# EAGLE design smart_watch_shield (EAGLE 9.4.2)
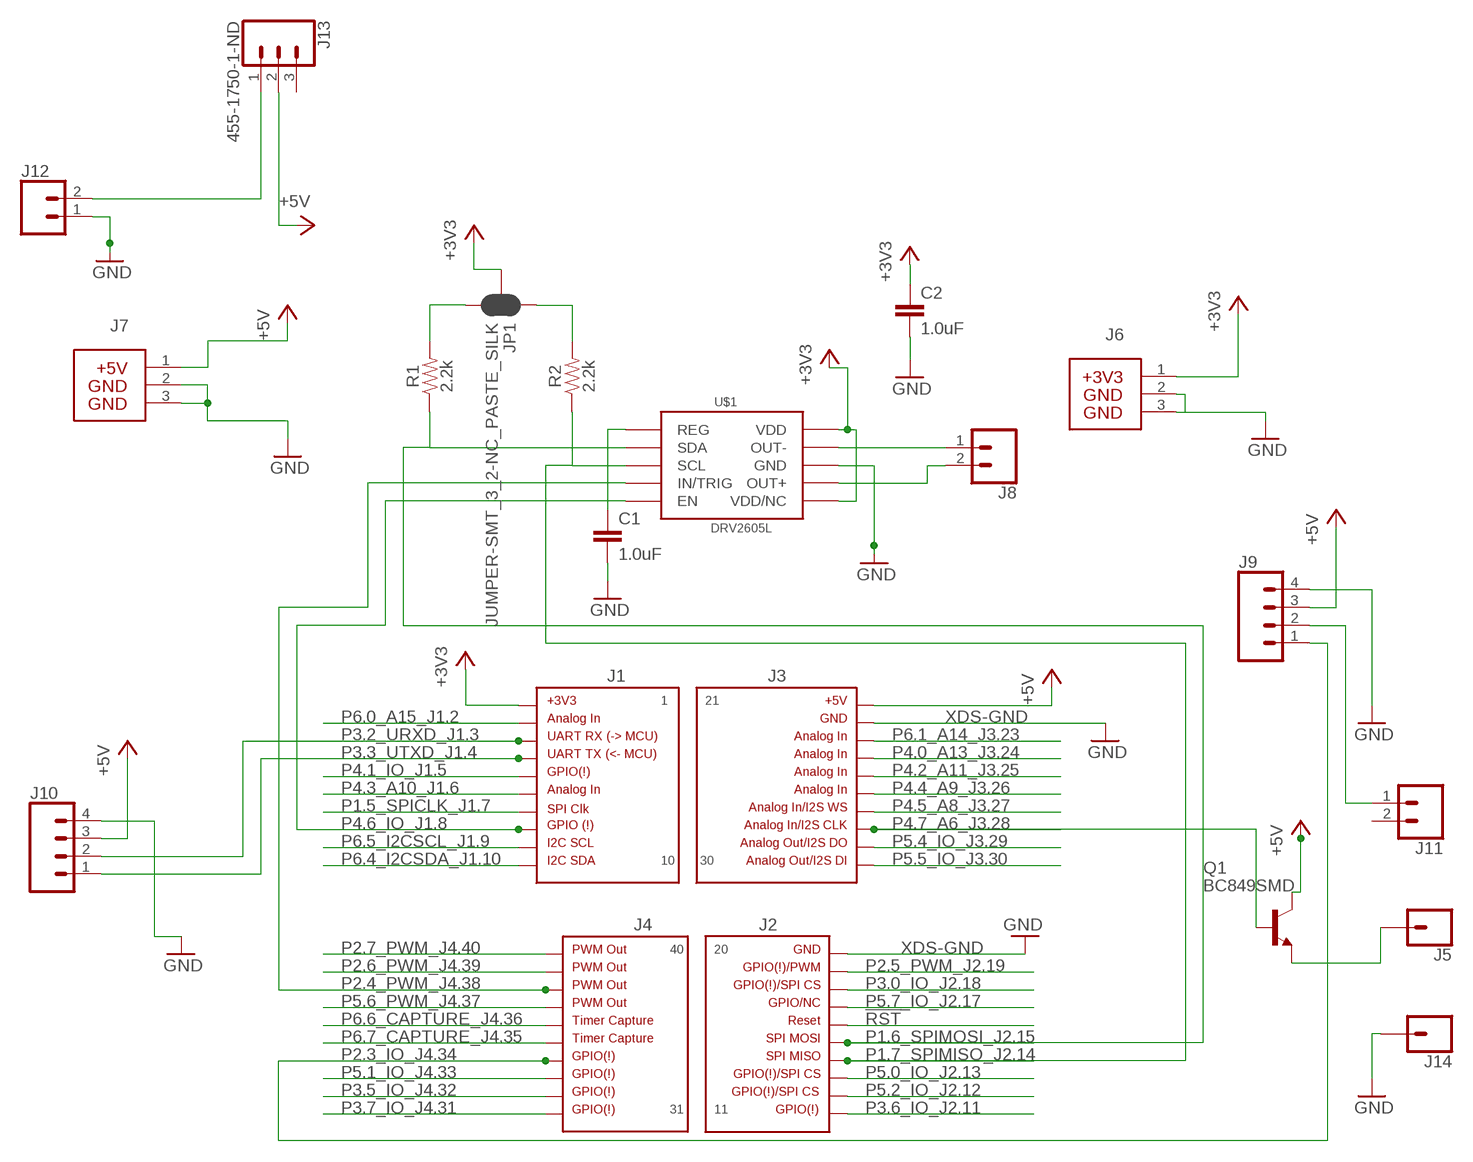
[diagram p0: schematic, sheet 1]

## Parts
C1  1.0uF  1.0UF-0805-25V-10%  [0805]
C2  1.0uF  1.0UF-0805-25V-10%  [0805]
J1  HEADER1X10-J1SILK_LABELS  [J1]
J2  HEADER1X10-J2SILK_LABELS  [J2]
J3  HEADER1X10-J3  [J3]
J4  HEADER1X10-J4SILK_LABELS  [J4]
J5  CONN_01  [1X01]
J6  HEADER 1X03  BP_HEADERS_PWR_3V3100-TH  [3PIN_PWR_3V3]
J7  BP_HEADERS_PWR_5V  [3PIN_PWR_5V]
J8  CONN_02  [1X02]
J9  CONN_04PTH  [1X04]
J10  CONN_04PTH  [1X04]
J11  CONN_02  [1X02]
J12  CONN_02  [1X02]
J13  455-1750-1-ND  CONN_03  [1X03]
J14  CONN_01  [1X01]
JP1  JUMPER-SMT_3_2-NC_PASTE_SILK  [SMT-JUMPER_3_2-NC_PASTE_SILK]
Q1  BC849SMD  [SOT23-BEC]
R1  2.2k  2.2KOHM-0603-1/10W-1%  [0603]
R2  2.2k  2.2KOHM-0603-1/10W-1%  [0603]
U$1  DRV2605L  [VSSOP-10]

## Nets
!RST: J2.16
+3V3: C2.1 J1.1 J6.1 JP1.2 U$1.P$6(VDD/NC) U$1.P$10(VDD)
+5V [Power]: J3.21 J7.1 J9.3 J10.3 J13.2 Q1.C
GND: C1.2 C2.2 J6.2 J6.3 J7.2 J7.3 J9.4 J10.4 J12.1 J14.1 U$1.P$8(GND)
N$1: JP1.3 R1.2
N$2: JP1.1 R2.2
N$3: J8.1 U$1.P$9(OUT-)
N$4: J9.2 J11.1
N$5: J12.2 J13.1
N$6: J5.1 Q1.E
N$8: C1.1 U$1.P$1(REG)
N$9: J8.2 U$1.P$7(OUT+)
P1.5_SPICLK_J1.7: J1.7
P1.6_SPIMOSI_J2.15: J2.15 R1.1 U$1.P$3(SDA)
P1.7_SPIMISO_J2.14: J2.14 R2.1 U$1.P$2(SCL)
P2.3_IO_J4.34: J4.34 J9.1
P2.4_PWM_J4.38: J4.38 U$1.P$4(IN/TRIG)
P2.5_PWM_J2.19: J2.19
P2.6_PWM_J4.39: J4.39
P2.7_PWM_J4.40: J4.40
P3.0_IO_J2.18: J2.18
P3.2_URXD_J1.3: J1.3 J10.2
P3.3_UTXD_J1.4: J1.4 J10.1
P3.5_IO_J4.32: J4.32
P3.6_IO_J2.11: J2.11
P3.7_IO_J4.31: J4.31
P4.0_A13_J3.24: J3.24
P4.1_IO_J1.5: J1.5
P4.2_A11_J3.25: J3.25
P4.3_A10_J1.6: J1.6
P4.4_A9_J3.26: J3.26
P4.5_A8_J3.27: J3.27
P4.6_IO_J1.8: J1.8 U$1.P$5(EN)
P4.7_A6_J3.28: J3.28 Q1.B
P5.0_IO_J2.13: J2.13
P5.1_IO_J4.33: J4.33
P5.2_IO_J2.12: J2.12
P5.4_IO_J3.29: J3.29
P5.5_IO_J3.30: J3.30
P5.6_PWM_J4.37: J4.37
P5.7_IO_J2.17: J2.17
P6.0_A15_J1.2: J1.2
P6.1_A14_J3.23: J3.23
P6.4_I2CSDA_J1.10: J1.10
P6.5_I2CSCL_J1.9: J1.9
P6.6_CAPTURE_J4.36: J4.36
P6.7_CAPTURE_J4.35: J4.35
XDS-GND: J2.20 J3.22 ; supply symbol labelled GND
Unconnected: J11.2 J13.3

## Library data of the parts
C1 C2 = SparkFun-Capacitors:1.0UF: 1µF ceramic capacitors A capacitor is a passive two-terminal electrical component used to store electrical energy temporarily in an electric field.; PROD_ID: CAP-08064
J1 = MSP430_Headers:HEADER1X10-J1
J2 = MSP430_Headers:HEADER1X10-J2
J3 = MSP430_Headers:HEADER1X10-J3
J4 = MSP430_Headers:HEADER1X10-J4
J5 J14 = SparkFun-Connectors:CONN_01: Single connection point. Often used as Generic Header-pin footprint for 0.1 inch spaced/style header connections On any of the 0.1 inch spaced packages, you can populate with these: Break Away Headers - Straight <https://www.sparkfun.com/products/116> (PRT-00116) Break Away Male Headers - Right Angle <https://www.sparkfun.com/products/553> (PRT-00553) Female Headers <https://www.sparkfun.com/products/115> (PRT-00115) Break Away Headers - Machine Pin <https://www.sparkfun.com/products/117> (PRT-00117) Break Away Female Headers - Swiss Machine Pin <https://www.sparkfun.com/products/743> (PRT-00743) This device is also useful as a general connection point to wire up your design to another part of your project. Our various solder wires solder well into these plated through hole pads. Hook-Up Wire - Assortment (Stranded, 22 AWG) <https://www.sparkfun.com/products/11375> (PRT-11375) Hook-Up Wire - Assortment (Solid Core, 22 AWG) <https://www.sparkfun.com/products/11367> (PRT-11367) View the entire wire category on our website here <https://www.sparkfun.com/categories/141> Special notes: SMTSO-256-ET is a "flush mount" nut for a 4-40 screw. We mostly use this on specialty testbeds; it is a nice way to connect hardware to your PCB at an adjustable hieght. Also note, the SNAP packages are for using a snappable style connector. We sell a baggie of snaps and they are also used on two LilyPad designs: Snap Assortment - 30 pack (male and female) <https://www.sparkfun.com/products/11347> (DEV-11347) LilyPad Arduino SimpleSnap <https://www.sparkfun.com/products/10941> (DEV-10941) LilyPad SimpleSnap Protoboard <https://www.sparkfun.com/products/10940> (DEV-10940)
J6 = LaunchPad_Template_Library:BP_HEADERS_PWR_3V3; CCO: 258-0001299; DESCRIPTION: CONN HEADER .100 SINGL STR 3POS; MAN: SULLINS
J7 = LaunchPad_Template_Library:BP_HEADERS_PWR_5V
J8 J11 J12 = SparkFun-Connectors:CONN_02: Multi connection point. Often used as Generic Header-pin footprint for 0.1 inch spaced/style header connections On any of the 0.1 inch spaced packages, you can populate with these: Break Away Headers - Straight <https://www.sparkfun.com/products/116> (PRT-00116) Break Away Male Headers - Right Angle <https://www.sparkfun.com/products/553> (PRT-00553) Female Headers <https://www.sparkfun.com/products/115> (PRT-00115) Break Away Headers - Machine Pin <https://www.sparkfun.com/products/117> (PRT-00117) Break Away Female Headers - Swiss Machine Pin <https://www.sparkfun.com/products/743> (PRT-00743) For SCREWTERMINALS and SPRING TERMINALS visit here: Screw Terimnals on SparkFun.com <https://www.sparkfun.com/search/results?term=Screw+Terminals> (5mm/3.5mm/2.54mm spacing) This device is also useful as a general connection point to wire up your design to another part of your project. Our various solder wires solder well into these plated through hole pads. Hook-Up Wire - Assortment (Stranded, 22 AWG) <https://www.sparkfun.com/products/11375> (PRT-11375) Hook-Up Wire - Assortment (Solid Core, 22 AWG) <https://www.sparkfun.com/products/11367> (PRT-11367) View the entire wire category on our website here <https://www.sparkfun.com/categories/141> Special notes: Molex polarized connector foot print use with: PRT-08233 with associated crimp pins and housings. 2.54_SCREWTERM for use with PRT-10571. 3.5mm Screw Terminal footprints for PRT-08084 5mm Screw Terminal footprints for use with PRT-08432
J9 J10 = SparkFun-Connectors:CONN_04: Multi connection point. Often used as Generic Header-pin footprint for 0.1 inch spaced/style header connections On any of the 0.1 inch spaced packages, you can populate with these: Break Away Headers - Straight <https://www.sparkfun.com/products/116> (PRT-00116) Break Away Male Headers - Right Angle <https://www.sparkfun.com/products/553> (PRT-00553) Female Headers <https://www.sparkfun.com/products/115> (PRT-00115) Break Away Headers - Machine Pin <https://www.sparkfun.com/products/117> (PRT-00117) Break Away Female Headers - Swiss Machine Pin <https://www.sparkfun.com/products/743> (PRT-00743) For SCREWTERMINALS and SPRING TERMINALS visit here: Screw Terimnals on SparkFun.com <https://www.sparkfun.com/search/results?term=Screw+Terminals> (5mm/3.5mm/2.54mm spacing) This device is also useful as a general connection point to wire up your design to another part of your project. Our various solder wires solder well into these plated through hole pads. Hook-Up Wire - Assortment (Stranded, 22 AWG) <https://www.sparkfun.com/products/11375> (PRT-11375) Hook-Up Wire - Assortment (Solid Core, 22 AWG) <https://www.sparkfun.com/products/11367> (PRT-11367) View the entire wire category on our website here <https://www.sparkfun.com/categories/141> Special notes: Molex polarized connector foot print use with SKU : PRT-08231 with associated crimp pins and housings. 1MM SMD Version SKU: PRT-10208; PROD_ID: CONN-09696
J13 = SparkFun-Connectors:CONN_03: Multi connection point. Often used as Generic Header-pin footprint for 0.1 inch spaced/style header connections On any of the 0.1 inch spaced packages, you can populate with these: Break Away Headers - Straight <https://www.sparkfun.com/products/116> (PRT-00116) Break Away Male Headers - Right Angle <https://www.sparkfun.com/products/553> (PRT-00553) Female Headers <https://www.sparkfun.com/products/115> (PRT-00115) Break Away Headers - Machine Pin <https://www.sparkfun.com/products/117> (PRT-00117) Break Away Female Headers - Swiss Machine Pin <https://www.sparkfun.com/products/743> (PRT-00743) Stackable Header - 3 Pin (Female, 0.1") <https://www.sparkfun.com/products/13875> (PRT-13875) For SCREWTERMINALS and SPRING TERMINALS visit here: Screw Terimnals on SparkFun.com <https://www.sparkfun.com/search/results?term=Screw+Terminals> (5mm/3.5mm/2.54mm spacing) This device is also useful as a general connection point to wire up your design to another part of your project. Our various solder wires solder well into these plated through hole pads. Hook-Up Wire - Assortment (Stranded, 22 AWG) <https://www.sparkfun.com/products/11375> (PRT-11375) Hook-Up Wire - Assortment (Solid Core, 22 AWG) <https://www.sparkfun.com/products/11367> (PRT-11367) View the entire wire category on our website here <https://www.sparkfun.com/categories/141> Special notes: Molex polarized connector foot print use with SKU : PRT-08232 with associated crimp pins and housings.; PROD_ID: XXX-00000
JP1 = SparkFun-Jumpers:JUMPER-SMT_3_2-NC_PASTE: Normally closed solder jumper (2 of 2 connections) This jumper has an aperture in the stencil to allow solder paste to bridge both connections. Both connections are normally closed (NC). Wick off the solder to open the connection(s). Reapply solder to reclose the connection(s).
Q1 = transistor-npn:BC849*: NPN Transistor
R1 R2 = SparkFun-Resistors:2.2KOHM: 2.2kΩ resistor A resistor is a passive two-terminal electrical component that implements electrical resistance as a circuit element. Resistors act to reduce current flow, and, at the same time, act to lower voltage levels within circuits. - Wikipedia; PROD_ID: RES-08272
U$1 = SparkFun-IC-Special-Function:DRV2605L; PROD_ID: IC-13504

## Net classes
0 default: width 0.254 mm
2 Power: width 0.203 mm, drill 0.305 mm, clearance 0.152 mm to class 0, clearance 0.152 mm to class 1, clearance 0.152 mm

## Board
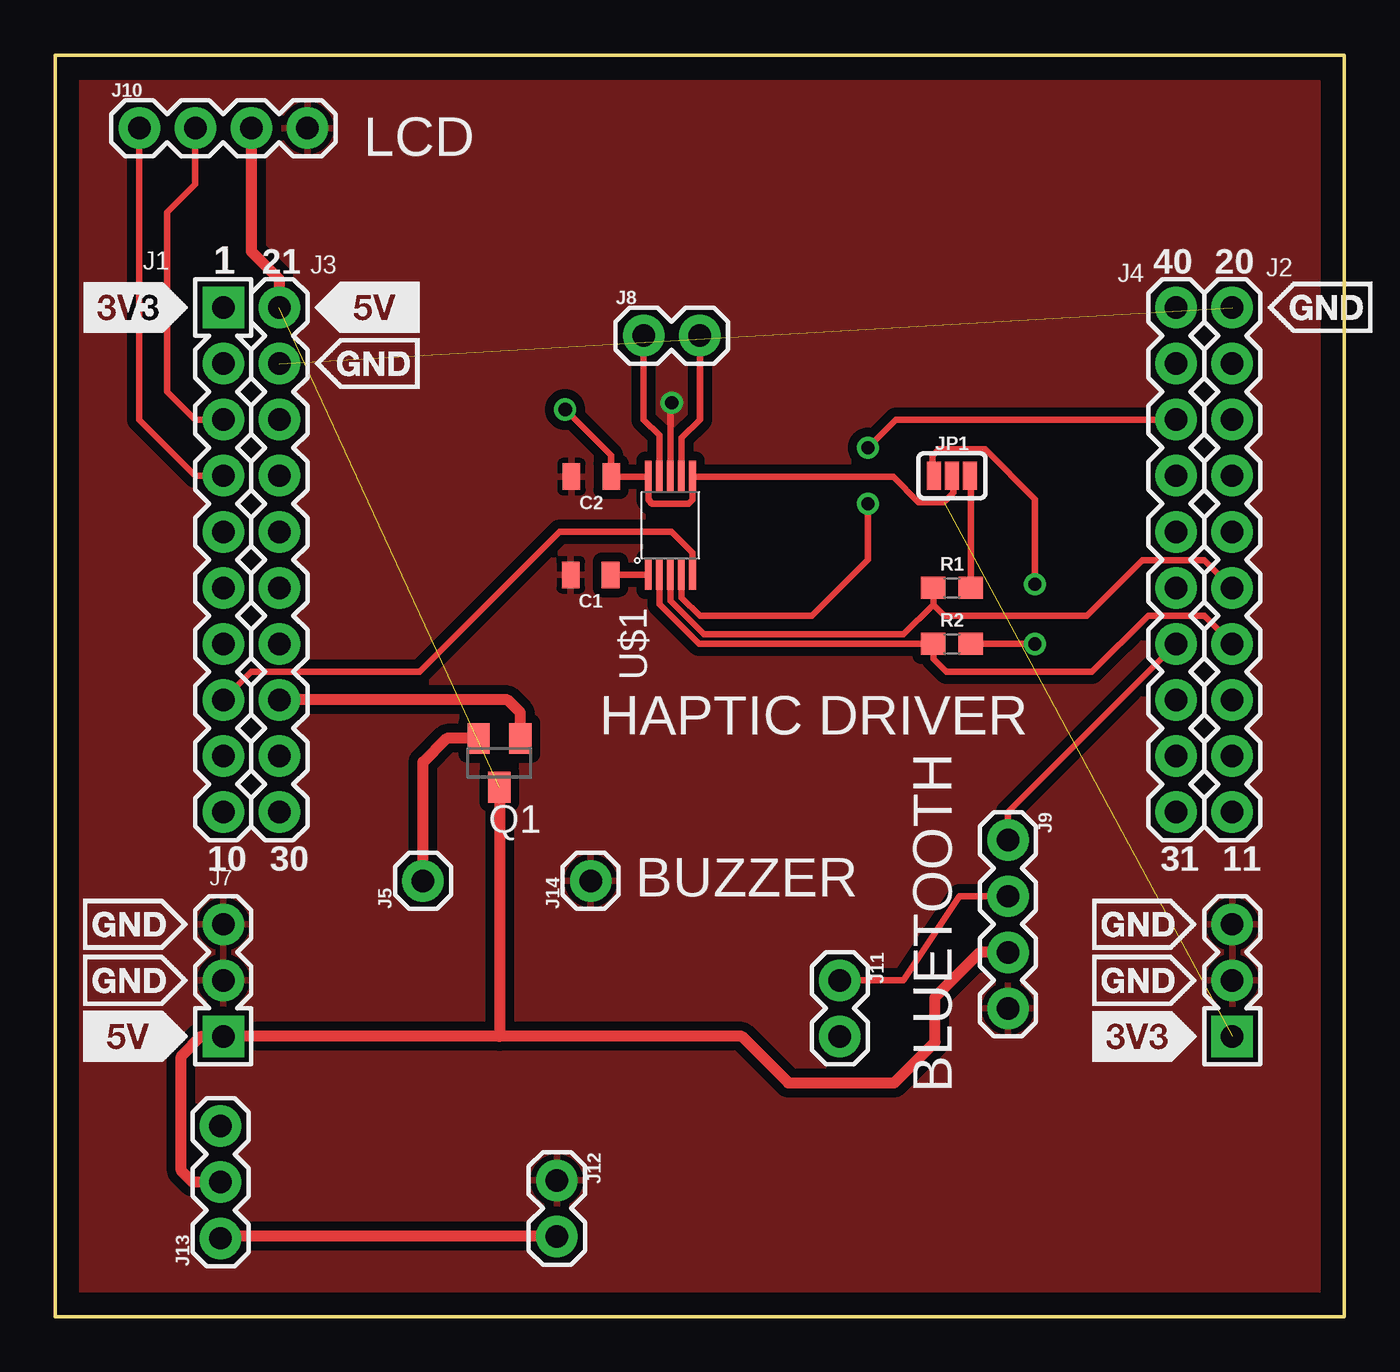
[diagram p1: board, top side]
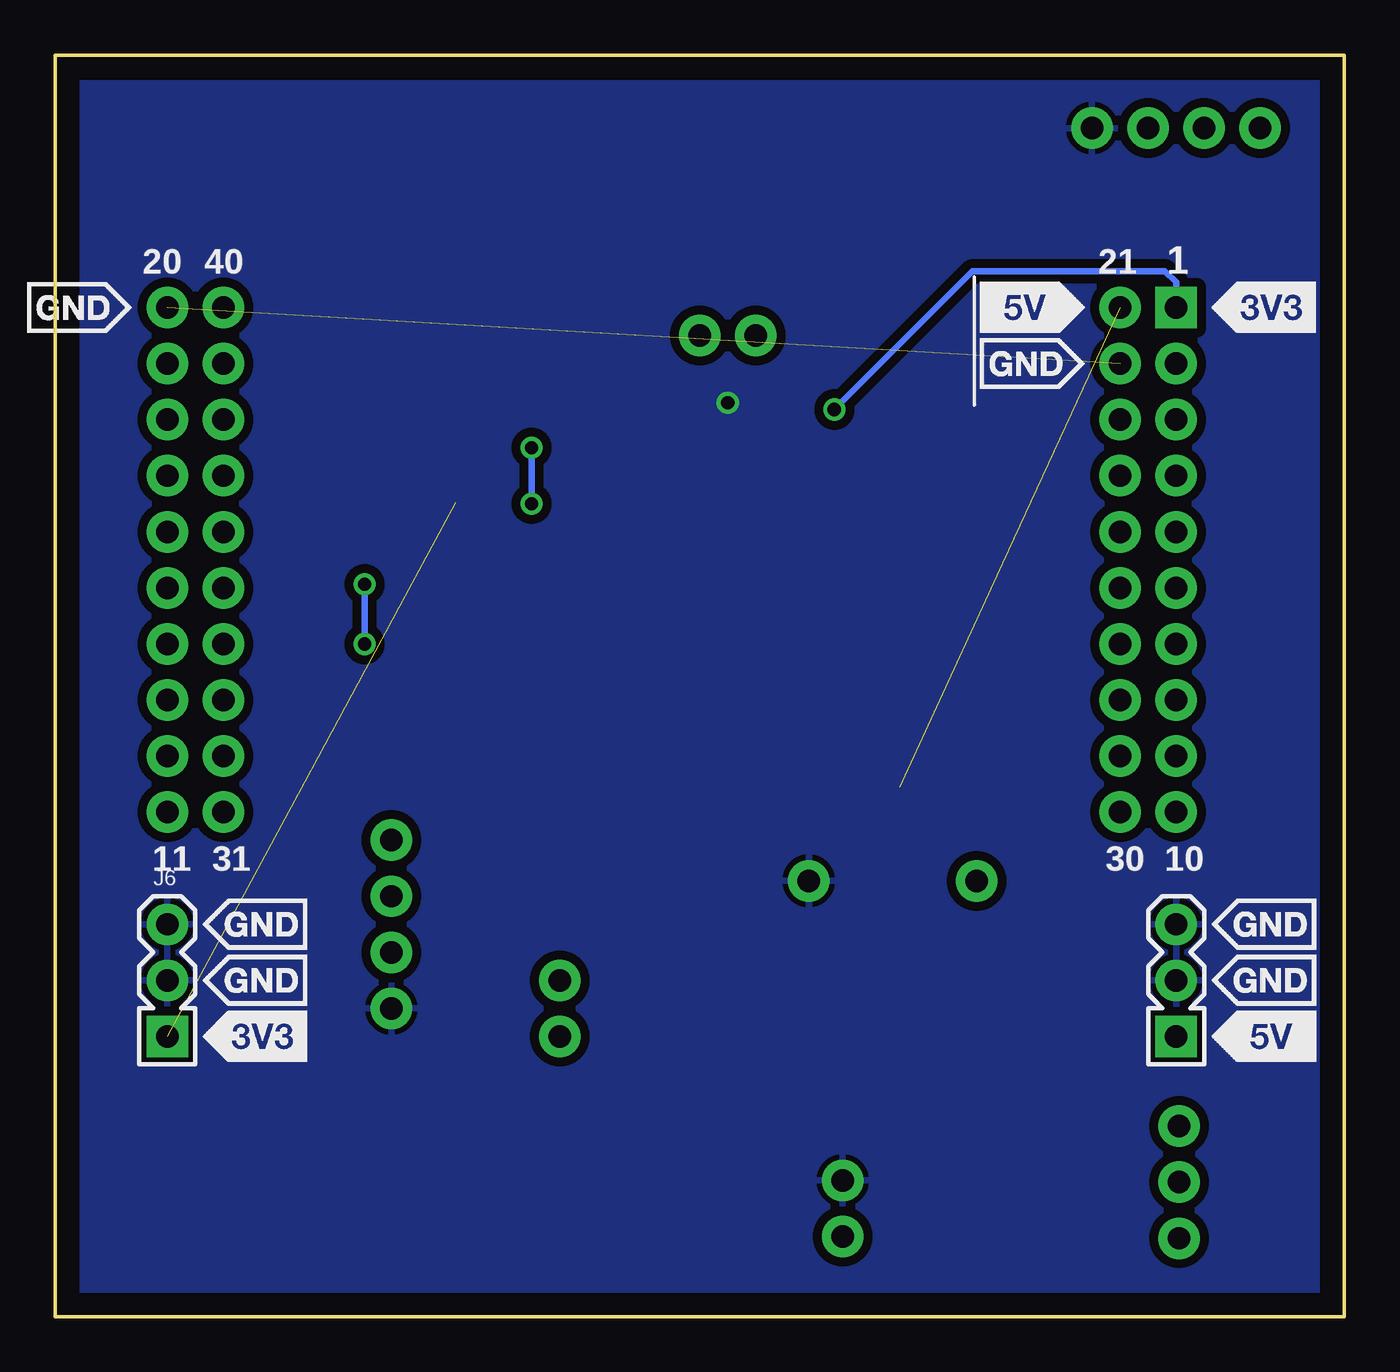
[diagram p2: board, bottom side, seen from below]

Size 58.42 x 57.15 mm. Coordinates in mm from the lower left corner, seen from the top.
Outline: 0,0 0,57.15 58.42,57.15 58.42,0 0,0
Copper layers (1*16): Top 0.035mm / dielectric 1.5mm / Bottom 0.035mm
Design rules "default *": minimum track width 12mil, minimum drill 0.6mm, track to track 12mil, track to pad 12mil, pad to pad 12mil, via to via 12mil, smd to smd 12mil, copper to edge 40mil, drill to drill 6mil, minimum pad ring 10mil, minimum via ring 8mil, stop-mask expansion 4mil, vias tented up to drill 0mil, thermal gap 10mil

### Footprints (pad centres in the part's own frame; a part is rotated, then mirrored left to right if it is on the bottom)
0805 = smd 0.8 x 1.2: 1 -0.9,0; 2 0.9,0
J1 = drill 1.016 pad 1.88 square: 1 0,11.43 | drill 1.016 pad 1.88: 2 0,8.89; 3 0,6.35; 4 0,3.81; 5 0,1.27; 6 0,-1.27; 7 0,-3.81; 8 0,-6.35; 9 0,-8.89; 10 0,-11.43
J2 = drill 1.016 pad 1.88: 11 0,-11.43; 12 0,-8.89; 13 0,-6.35; 14 0,-3.81; 15 0,-1.27; 16 0,1.27; 17 0,3.81; 18 0,6.35; 19 0,8.89; 20 0,11.43
J3 = drill 1.016 pad 1.88: 21 0,11.43; 22 0,8.89; 23 0,6.35; 24 0,3.81; 25 0,1.27; 26 0,-1.27; 27 0,-3.81; 28 0,-6.35; 29 0,-8.89; 30 0,-11.43
J4 = drill 1.016 pad 1.88: 31 0,-11.43; 32 0,-8.89; 33 0,-6.35; 34 0,-3.81; 35 0,-1.27; 36 0,1.27; 37 0,3.81; 38 0,6.35; 39 0,8.89; 40 0,11.43
1X01 = drill 1.016 pad 1.88: 1 0,0
3PIN_PWR_3V3 = drill 1.016 pad 1.88 square: 1 0,0 | drill 1.016 pad 1.88: 2 0,2.54; 3 0,5.08
3PIN_PWR_5V = drill 1.016 pad 1.88 square: 1 0,0 | drill 1.016 pad 1.88: 2 0,2.54; 3 0,5.08
1X02 = drill 1.016 pad 1.88: 1 0,0; 2 2.54,0
1X04 = drill 1.016 pad 1.88: 1 0,0; 2 2.54,0; 3 5.08,0; 4 7.62,0
1X03 = drill 1.016 pad 1.88: 1 0,0; 2 2.54,0; 3 5.08,0
SMT-JUMPER_3_2-NC_PASTE_SILK = smd 0.635 x 1.27: 1 -0.813,0; 2 0,0; 3 0.813,0
SOT23-BEC = smd 1 x 1.4: B -0.95,-1.1; C 0,1.1; E 0.95,-1.1
0603 = smd 1.1 x 1: 1 -0.85,0; 2 0.85,0
VSSOP-10 = smd 1.45 x 0.3: P$1 -1.905,1.06; P$2 -1.905,0.56; P$3 -1.905,0.06; P$4 -1.905,-0.44; P$5 -1.905,-0.94; P$6 2.495,-0.94; P$7 2.495,-0.44; P$8 2.495,0.06; P$9 2.495,0.56; P$10 2.495,1.06

### Placement (x,y rotation side)
C1  24.26,33.61 180 top
C2  24.3,38.06 180 top
J1  7.62,34.29 0 top
J2  53.34,34.29 0 top
J3  10.16,34.29 0 top
J4  50.8,34.29 0 top
J5  16.67,19.75 90 top
J6  53.34,12.7 0 bottom
J7  7.62,12.7 0 top
J8  26.67,44.45 0 top
J9  43.18,21.59 270 top
J10  3.81,53.85 0 top
J11  35.56,15.24 270 top
J12  22.73,6.18 270 top
J13  7.49,3.56 90 top
J14  24.27,19.75 90 top
JP1  40.64,38.1 0 top
Q1  20.13,25.1 180 top
R1  40.64,33.02 0 top
R2  40.64,30.48 0 top
U$1  27.94,35.56 90 top

### Tracks (layer width: path | path; a pad name or v marks a point on that pad's centre or on a via)
+3V3  (via drill 0.6)  (1 unrouted)
  Top 0.305: JP1.2 40.7,38.04 40.7,37.34 40.27,36.91 39.13,36.91 37.98,38.05 U$1.P$6 28.88,37.01 28.7,36.83 27.05,36.83 26.88,37 U$1.P$10 C2.1 25.2,39.02 v23.11,41.1
  Bottom 0.305: J1.1 7.62,46.86 8.13,47.37 16.86,47.37 v23.11,41.1
+5V  (1 unrouted)
  Top 0.508: 20.13,12.7 31.12,12.7 33.22,10.59 38.02,10.59 39.88,12.45 39.88,14.48 41.91,16.51 J9.3 | 20.13,12.7 J7.1 6.6,12.7 5.71,11.81 5.71,6.6 6.22,6.1 J13.2 | J10.3 8.89,48.26 10.16,46.99 J3.21 | Q1.C 20.13,12.7
GND  (via drill 0.6)
  Top 0.305: U$1.P$8 27.88,41.34 v27.94,41.4
  pour Top (isolate 0.406): 0,0 0,55.88 58.42,55.88 58.42,0
  pour Bottom (isolate 0.406): 0,0 0,55.88 58.42,55.88 58.42,0
N$1
  Top 0.305: R1.2 41.49,38.06 JP1.3
N$2  (via drill 0.6)
  Top 0.305: R2.2 v44.4,30.48 | JP1.1 39.76,38.16 39.76,39 40.06,39.29 42.15,39.29 44.4,37.04 v44.4,33.18
  Bottom 0.305: v44.4,33.18 v44.4,30.49 v44.4,30.48
N$3
  Top 0.305: U$1.P$9 27.38,39.93 26.67,40.64 J8.1
N$4
  Top 0.305: J9.2 40.98,19.05 38.44,15.24 J11.1
N$5
  Top 0.508: J12.2 7.57,3.64 J13.1
N$6
  Top 0.508: Q1.E 17.74,26.2 16.66,25.12 16.67,25.12 J5.1
N$8
  Top 0.305: U$1.P$1 26.83,33.61 C1.1
N$9
  Top 0.305: U$1.P$7 28.38,39.81 29.21,40.64 J8.2
P1.6_SPIMOSI_J2.15
  Top 0.305: 39.79,32.26 40.3,31.75 46.75,31.75 49.27,34.27 52.08,34.27 53.32,33.02 J2.15 | R1.1 39.79,32.26 | U$1.P$3 27.88,32.43 29.4,30.91 38.44,30.91 39.79,32.26
P1.7_SPIMISO_J2.14
  Top 0.305: J2.14 52.07,31.75 49.53,31.75 46.99,29.21 40.39,29.21 39.79,29.81 R2.1 29.19,30.48 27.38,32.29 U$1.P$2
P2.3_IO_J4.34
  Top 0.305: J9.1 43.18,22.86 J4.34
P2.4_PWM_J4.38  (via drill 0.6)
  Top 0.305: J4.38 38.1,40.64 v36.83,39.37 | v36.83,36.83 36.83,34.29 34.29,31.75 29.21,31.75 28.38,32.58 U$1.P$4
  Bottom 0.305: v36.83,39.37 v36.83,36.83
P3.2_URXD_J1.3
  Top 0.305: J10.2 6.35,51.31 5.08,50.04 5.08,41.91 6.35,40.64 J1.3
P3.3_UTXD_J1.4
  Top 0.305: J10.1 3.81,40.64 6.35,38.1 J1.4
P4.6_IO_J1.8
  Top 0.305: J1.8 8.89,29.21 16.51,29.21 22.86,35.56 27.94,35.56 28.88,34.62 U$1.P$5
P4.7_A6_J3.28
  Top 0.508: Q1.B 21.08,27.36 20.5,27.94 J3.28
XDS-GND  (1 unrouted)

### Text on the board
tPlace: LCD | HAPTIC DRIVER | BUZZER | BLUETOOTH